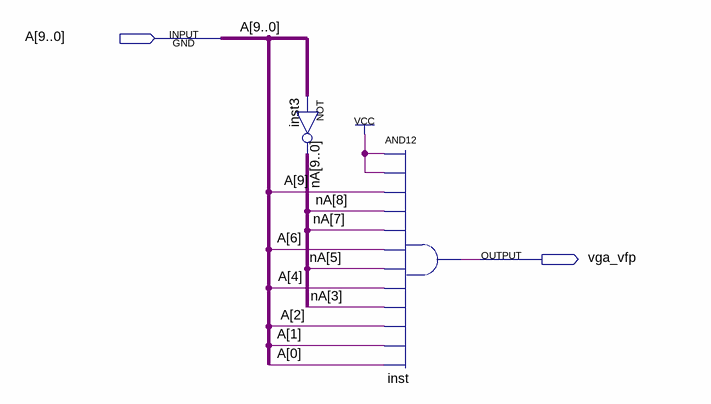
[diagram p0: schematic sheet]
// Quartus schematic vga_vfp.bdf as structural Verilog: 2 symbols, 2 pins
module vga_vfp (
  input  [9:0] A,
  output vga_vfp
);

  wire [9:0] nA;

  assign nA = ~A;  // NOT inst3, 10 bits wide
  and inst (vga_vfp, 1'b1, 1'b1, A[9], nA[8], nA[7], A[6], nA[5], A[4], nA[3], A[2], A[1], A[0]);
endmodule
